# Altium project lab2_ignatova_buck_boost.PrjPcb
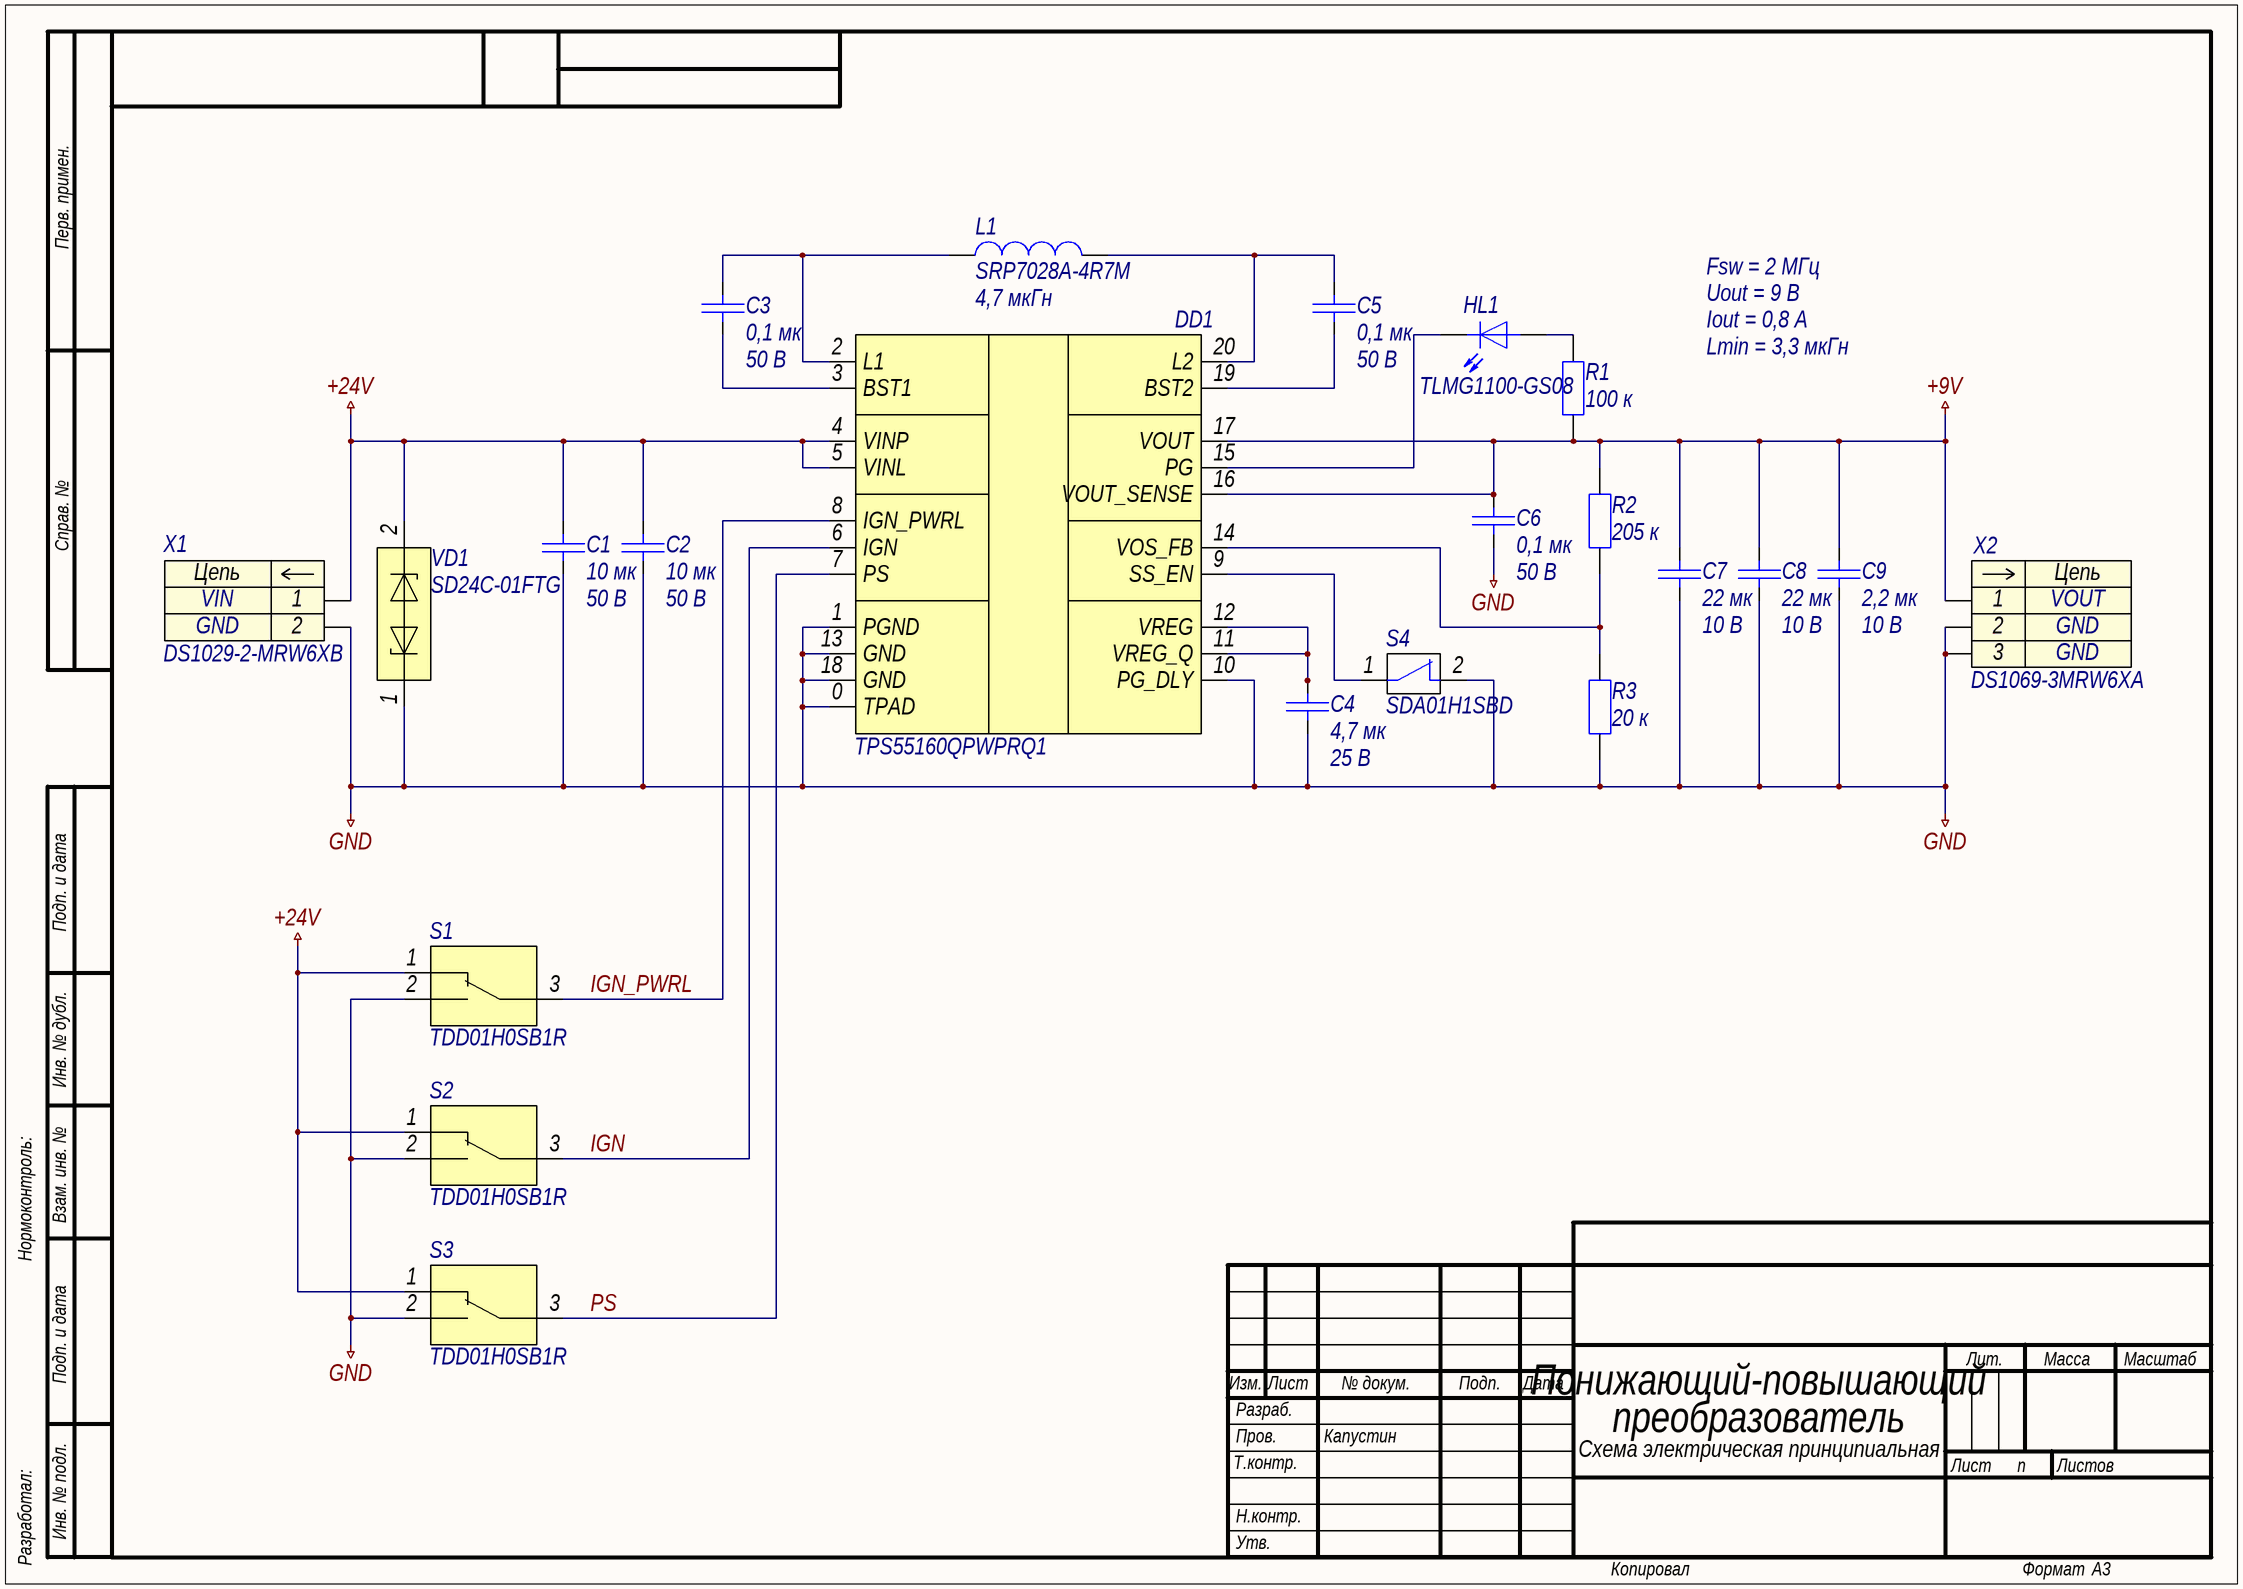
[diagram p0: lab2_ignatova_buck_boost.SchDoc]
approver: Капустин; check: Капустин; designation: СПБПУ.3331506.007; developer: Игнатова; document_code: Ý3; document_type: Схема электрическая принципиальная; pcb_dec_number: СПБПУ.3331506.007; project: lab2_ignatova_buck_boost; sheets_total: 1; title: Понижающий-повышающий преобразователь; title_line_1: Понижающий-повышающий; title_line_2: преобразователь
1 sheet, 22 parts. Net scope: global (net labels, ports and power ports of the same name join across sheets).
Board file: lab2_ignatova_buck_boost.PcbDoc

## Sheet lab2_ignatova_buck_boost.SchDoc: Понижающий-повышающий преобразователь
size 420 x 297 mm; ApprovedBy: Капустин; CheckedBy: Капустин; DrawnBy: Игнатова; DocumentNumber: СПБПУ.3331506.007Ý3; SheetNumber: n; SheetTotal: 1; DocumentCode: Ý3; ImagePath: СПБПУ.3331506.007

### Parts
C1  10 мк  Напряжение: 50 В  [C1206]
C2  10 мк  Напряжение: 50 В  [C1206]
C3  0,1 мк  Напряжение: 50 В  [C0603]
C4  4,7 мк  Напряжение: 25 В  [C0603]
C5  0,1 мк  Напряжение: 50 В  [C0603]
C6  0,1 мк  Напряжение: 50 В  [C0603]
C7  22 мк  Напряжение: 10 В  [C0603]
C8  22 мк  Напряжение: 10 В  [C0603]
C9  2,2 мк  Напряжение: 10 В  [C0603]
DD1  TPS55160QPWPRQ1  [HTSSOP-20]
HL1  TLMG1100-GS08  [HL0603]
L1  SRP7028A-4R7M  Индуктивность: 4,7 мкГн  [SRP-2-730X660X280]
R1  100 к  [R0603]
R2  205 к  [R0603]
R3  20 к  [R0603]
S1  TDD01H0SB1R  [TDD01H0SB1R]
S2  TDD01H0SB1R  [TDD01H0SB1R]
S3  TDD01H0SB1R  [TDD01H0SB1R]
S4  SDA01H1SBD  [SDA01H1SBD]
VD1  SD24C-01FTG  [SOD-323]
X1  DS1029-2-MRW6XB  [DS1029-2-MRW6XB]
X2  DS1069-3MRW6XA  [DS1069-3MRW6XA]

### Nets
+9V: C6.1 C7.1 C8.1 C9.1 DD1.16(VOUT_SENSE) DD1.17(VOUT) R1.2 R2.2 X2.1
+24V: C1.1 C2.1 DD1.4(VINP) DD1.5(VINL) S1.1 S2.1 S3.1 VD1.2 X1.1
GND: C1.2 C2.2 C4.2 C6.2 C7.2 C8.2 C9.2 DD1.0(TPAD) DD1.1(PGND) DD1.10(PG_DLY) DD1.13(GND) DD1.18(GND) R3.1 S1.2 S2.2 S3.2 S4.2 VD1.1 X1.2 X2.2 X2.3
IGN: DD1.6(IGN) S2.3
IGN_PWRL: DD1.8(IGN_PWRL) S1.3
PS: DD1.7(PS) S3.3
NetC3_1: C3.1 DD1.2(L1) L1.1
NetC3_2: C3.2 DD1.3(BST1)
NetC4_1: C4.1 DD1.11(VREG_Q) DD1.12(VREG)
NetC5_1: C5.1 DD1.20(L2) L1.2
NetC5_2: C5.2 DD1.19(BST2)
NetDD1_9: DD1.9(SS_EN) S4.1
NetDD1_14: DD1.14(VOS_FB) R2.1 R3.2
NetDD1_15: DD1.15(PG) HL1.1
NetHL1_2: HL1.2 R1.1

### Notes on the sheet
- Fsw = 2 МГц
- Uout = 9 В
- Iout = 0,8 А
- Lmin = 3,3 мкГн
- Перв. примен.
- Справ. №
- Подп. и дата
- Инв. № дубл.
- Нормоконтроль:
- Взам. инв. №
- Изм.
- Лист
- № докум.
- Подп.
- Дата
- Лит.
- Масса
- Масштаб
- Т.контр.
- Пров.
- Разраб.
- Листов
- Разработал:
- Инв. № подл.
- Н.контр.
- Утв.
- Копировал
- Формат
- А3
- (in symbol x0006) Цепь
- (in symbol x0019) Цепь

### Library data of the parts
C1 C2 = c0094: =Описание; ID: c0094; Фамилия: Самарин; Описание: Конденсатор чип 1206 10 мкФ 50 В ±10 %; Наименование: CC1206KKX5R9BB106; Производитель: YAGEO Corp.; Отклонение: ±10 %; Рабочие температуры: от –55 °С до +85 °С; Температурный коэффициент емкости: X5R; Корпус: 1206; Номинал: 10 мк; Номинальное напряжение: 50 В; HelpURL: https://www.yageo.com/upload/media/product/productsearch/datasheet/mlcc/UPY-GPHC_X5R_4V-to-50V_26.pdf
C3 C5 C6 = c0036: =Описание; ID: c0036; Фамилия: Ларионов; Описание: Конденсатор чип 0603 100 нФ 50 В ±5 %; Наименование: CC0603JRX7R9BB104; Производитель: YAGEO Corp.; Отклонение: ±5 %; Рабочие температуры: от –55 °С до +125 °С; Температурный коэффициент емкости: X7R; Корпус: 0603; Номинал: 0,1 мк; Номинальное напряжение: 50 В; HelpURL: https://www.yageo.com/upload/media/product/products/datasheet/mlcc/UPY-GPHC_X7R_6.3V-to-50V_20.pdf
C4 = c0082: =Описание; ID: c0082; Фамилия: Ларионов; Описание: Конденсатор чип 0603 4,7 мкФ 25 В ±10 %; Наименование: CC0603KRX5R8BB475; Производитель: YAGEO Corp.; Отклонение: ±10 %; Рабочие температуры: от –55 °С до +85 °С; Температурный коэффициент емкости: X5R; Корпус: 0603; Номинал: 4,7 мк; Номинальное напряжение: 25 В; HelpURL: https://www.yageo.com/upload/media/product/productsearch/datasheet/mlcc/UPY-GPHC_X5R_4V-to-50V_26.pdf
C7 C8 = c0101: =Описание; ID: c0101; Фамилия: Чернов; Описание: Конденсатор чип 0603 22 мкФ 10 В ±20 %; Наименование: CC0603MPX5R6BB226; Производитель: YAGEO Corp.; Отклонение: ±20 %; Рабочие температуры: от –55 °С до +85 °С; Температурный коэффициент емкости: X5R; Корпус: 0603; Номинал: 22 мк; Номинальное напряжение: 10 В; HelpURL: https://www.yageo.com/upload/media/product/productsearch/datasheet/mlcc/UPY-GPHC_X5R_4V-to-50V_26.pdf
C9 = c0025: =Описание; ID: c0025; Фамилия: Чернов; Описание: Конденсатор чип 0603 2,2 мкФ 10 В ±10 %; Наименование: CC0603KRX7R6BB225; Производитель: YAGEO Corp.; Отклонение: ±10 %; Рабочие температуры: от -55 °С до +125 °С; Корпус: 0603; Номинал: 2,2 мк; Номинальное напряжение: 10 В; HelpURL: https://www.yageo.com/upload/media/product/productsearch/datasheet/mlcc/UPY-GPHC_X7R_6.3V-to-50V_20.pdf
DD1 = dd0012: =Описание; ID: dd0012; Фамилия: Игнатова; Описание: Повышающий/понижающий преобразователь напряжения 36 В и 1 А; Производитель: Texas Instruments; Входное напряжение: от 3,6 В до 36 В; Выходное напряжение: от 5,7 В до 9 В; Коммутируемый ток: до 1 А; Частота переключения: 2 МГц; Рабочие температуры: от –40 °С до +125 °С; Наименование: TPS55160QPWPRQ1; Корпус: HTSSOP-20; HelpURL: https://www.ti.com/product/TPS55160-Q1
HL1 = hl0005: =Описание; ID: hl0005; Фамилия: Ларионов; Описание: Светодиод чип 0603 зеленый; Производитель: Vishay Intertechnology, Inc.; Цвет: Green; Номинальная сила света: 35 мкд; Номинальная длина волны: 570 нм; Номинальный прямой ток: 30 мА; Номинальное падение напряжения: 2,1 В; Рассеиваемая мощность: 90 мВт; Рабочие температуры: от -40 °С до +100 °С; Корпус: 0603; Наименование: TLMG1100-GS08; HelpURL: https://www.vishay.com/leds/list/product-83173/
L1 = l0003: =Описание; ID: l0003; Фамилия: Игнатова; Описание: Катушка индуктивности 4,7 мкГн ±20 %; Производитель: Bourns, Inc.; Отклонение: ±20 %; Номинальное активное сопротивление: 37 мОм; Максимальное активное сопротивление: 40 мОм; Резонансная частота: 21 МГц; Номинальный ток (при нагреве на 20 °С/40 °С): 5,5 А; Ток насыщения: 10 А; Рабочее напряжение: не указано; Рабочие температуры: от –55 °С до +150 °С; Корпус: 7,3 x 6,6 x 2,8; Наименование: SRP7028A-4R7M; Номинал: 4,7 мкГн; HelpURL: https://www.bourns.com/products/magnetic-products/power-inductors-aec-q200-compliant/product/SRP7028A
R1 = r0028: =Описание; ID: r0028; Фамилия: Водорезов; Описание: Резистор чип 0603 100 кОм ±1 % 0,1 Вт; Наименование: RC0603FR-07100KL; Производитель: YAGEO Corp.; Отклонение: ±1 %; Номинальное напряжение: 75 В; Рабочие температуры: от -55 °С до +155 °С; Номинальный ток: 1 А; Корпус: 0603; Номинал: 100 к; HelpURL: https://www.yageo.com/upload/media/product/productsearch/datasheet/rchip/PYu-RC_Group_51_RoHS_L_11.pdf
R2 = r0083: =Описание; ID: r0083; Фамилия: Игнатова; Описание: Резистор чип 0603 205 кОм ±1 % 0,1 Вт; Наименование: RC0603FR-07205KL; Производитель: YAGEO Corp.; Отклонение: ±1 %; Номинальное напряжение: 75 В; Рабочие температуры: от -55 °С до +155 °С; Номинальный ток: 1 А; Корпус: 0603; Номинал: 205 к
R3 = r0022: =Описание; ID: r0022; Фамилия: Паньков; Описание: Резистор чип 0603 20 кОм ±1 % 0,1 Вт; Наименование: RC0603FR-0720KL; Производитель: YAGEO Corp.; Отклонение: ±1 %; Номинальное напряжение: 75 В; Рабочие температуры: от -55 °С до +155 °С; Номинальный ток: 1 А; Корпус: 0603; Номинал: 20 к; HelpURL: https://www.yageo.com/upload/media/product/productsearch/datasheet/rchip/PYu-RC_Group_51_RoHS_L_11.pdf
S1-S3 = s0005: =Описание; ID: s0005; Фамилия: Игнатова; Описание: 2-х позиционный движковый переключатель; Производитель: C&K; Ток нагрузки: 25 мА @ 24 В; Сопротивление контакта: 100 мОм; Количество контактов: 3; Рабочие температуры: от –35 °С до +85 °С; Промывка: Разрешена; Корпус: 6,00х4,20х2,30; Наименование: TDD01H0SB1R; HelpURL: https://www.ckswitches.com/products/switches/product-details/DIP/TDD/TDD01H0SB1R/
S4 = s0002: =Описание; ID: s0002; Фамилия: Паньков; Описание: 2-х позиционный движковый переключатель; Производитель: C&K; Ток нагрузки: 100 мА @ 5 В; Сопротивление контакта: 50 мОм; Количество контактов: 2; Рабочие температуры: от –40 °С до +85 °С; Промывка: Разрешена; Корпус: 4,52х9,30х5,45; Наименование: SDA01H1SBD; HelpURL: https://www.ckswitches.com/products/switches/product-details/DIP/SDA/SDA01H1SBD/
VD1 = vd0005: =Описание; ID: vd0005; Фамилия: Игнатова; Описание: Двунаправленная диодная сборка для подавления помех, 24 В; Производитель: Littelfuse, Inc.; Наименование: SD24C-01FTG; Корпус: SOD-323; HelpURL: https://www.littelfuse.com/products/tvs-diode-arrays/general-purpose-esd-protection/sdc/sd24c_01ftg.aspx
X1 = x0006: =Описание; Contact_1: VIN; Contact_2: GND; ID: x0006; Фамилия: Ларионов; Описание: CWF 2 pin Type B 2,5 мм вилка угловой; Производитель: Connfly Electronic Co. LTD.; Наименование: DS1029-2-MRW6XB; HelpURL: http://www.connfly.com/productshow.aspx?id=352
X2 = x0019: =Описание; Contact_1: VOUT; Contact_2: GND; ID: x0019; Фамилия: Паньков; Описание: CWF 3 pin Type A 2,5 мм вилка угловой; Производитель: Connfly Electronic Co., Ltd.; Contact_3: GND; Наименование: DS1069-3MRW6XA; HelpURL: http://en.connfly.group/product/xVkr=EusQssAN0gN=Aos=mU+UrVkR9kqEAN0gN0MUR+g+NB+A